# Altium project ignatova_telemetry_board.PrjPcb
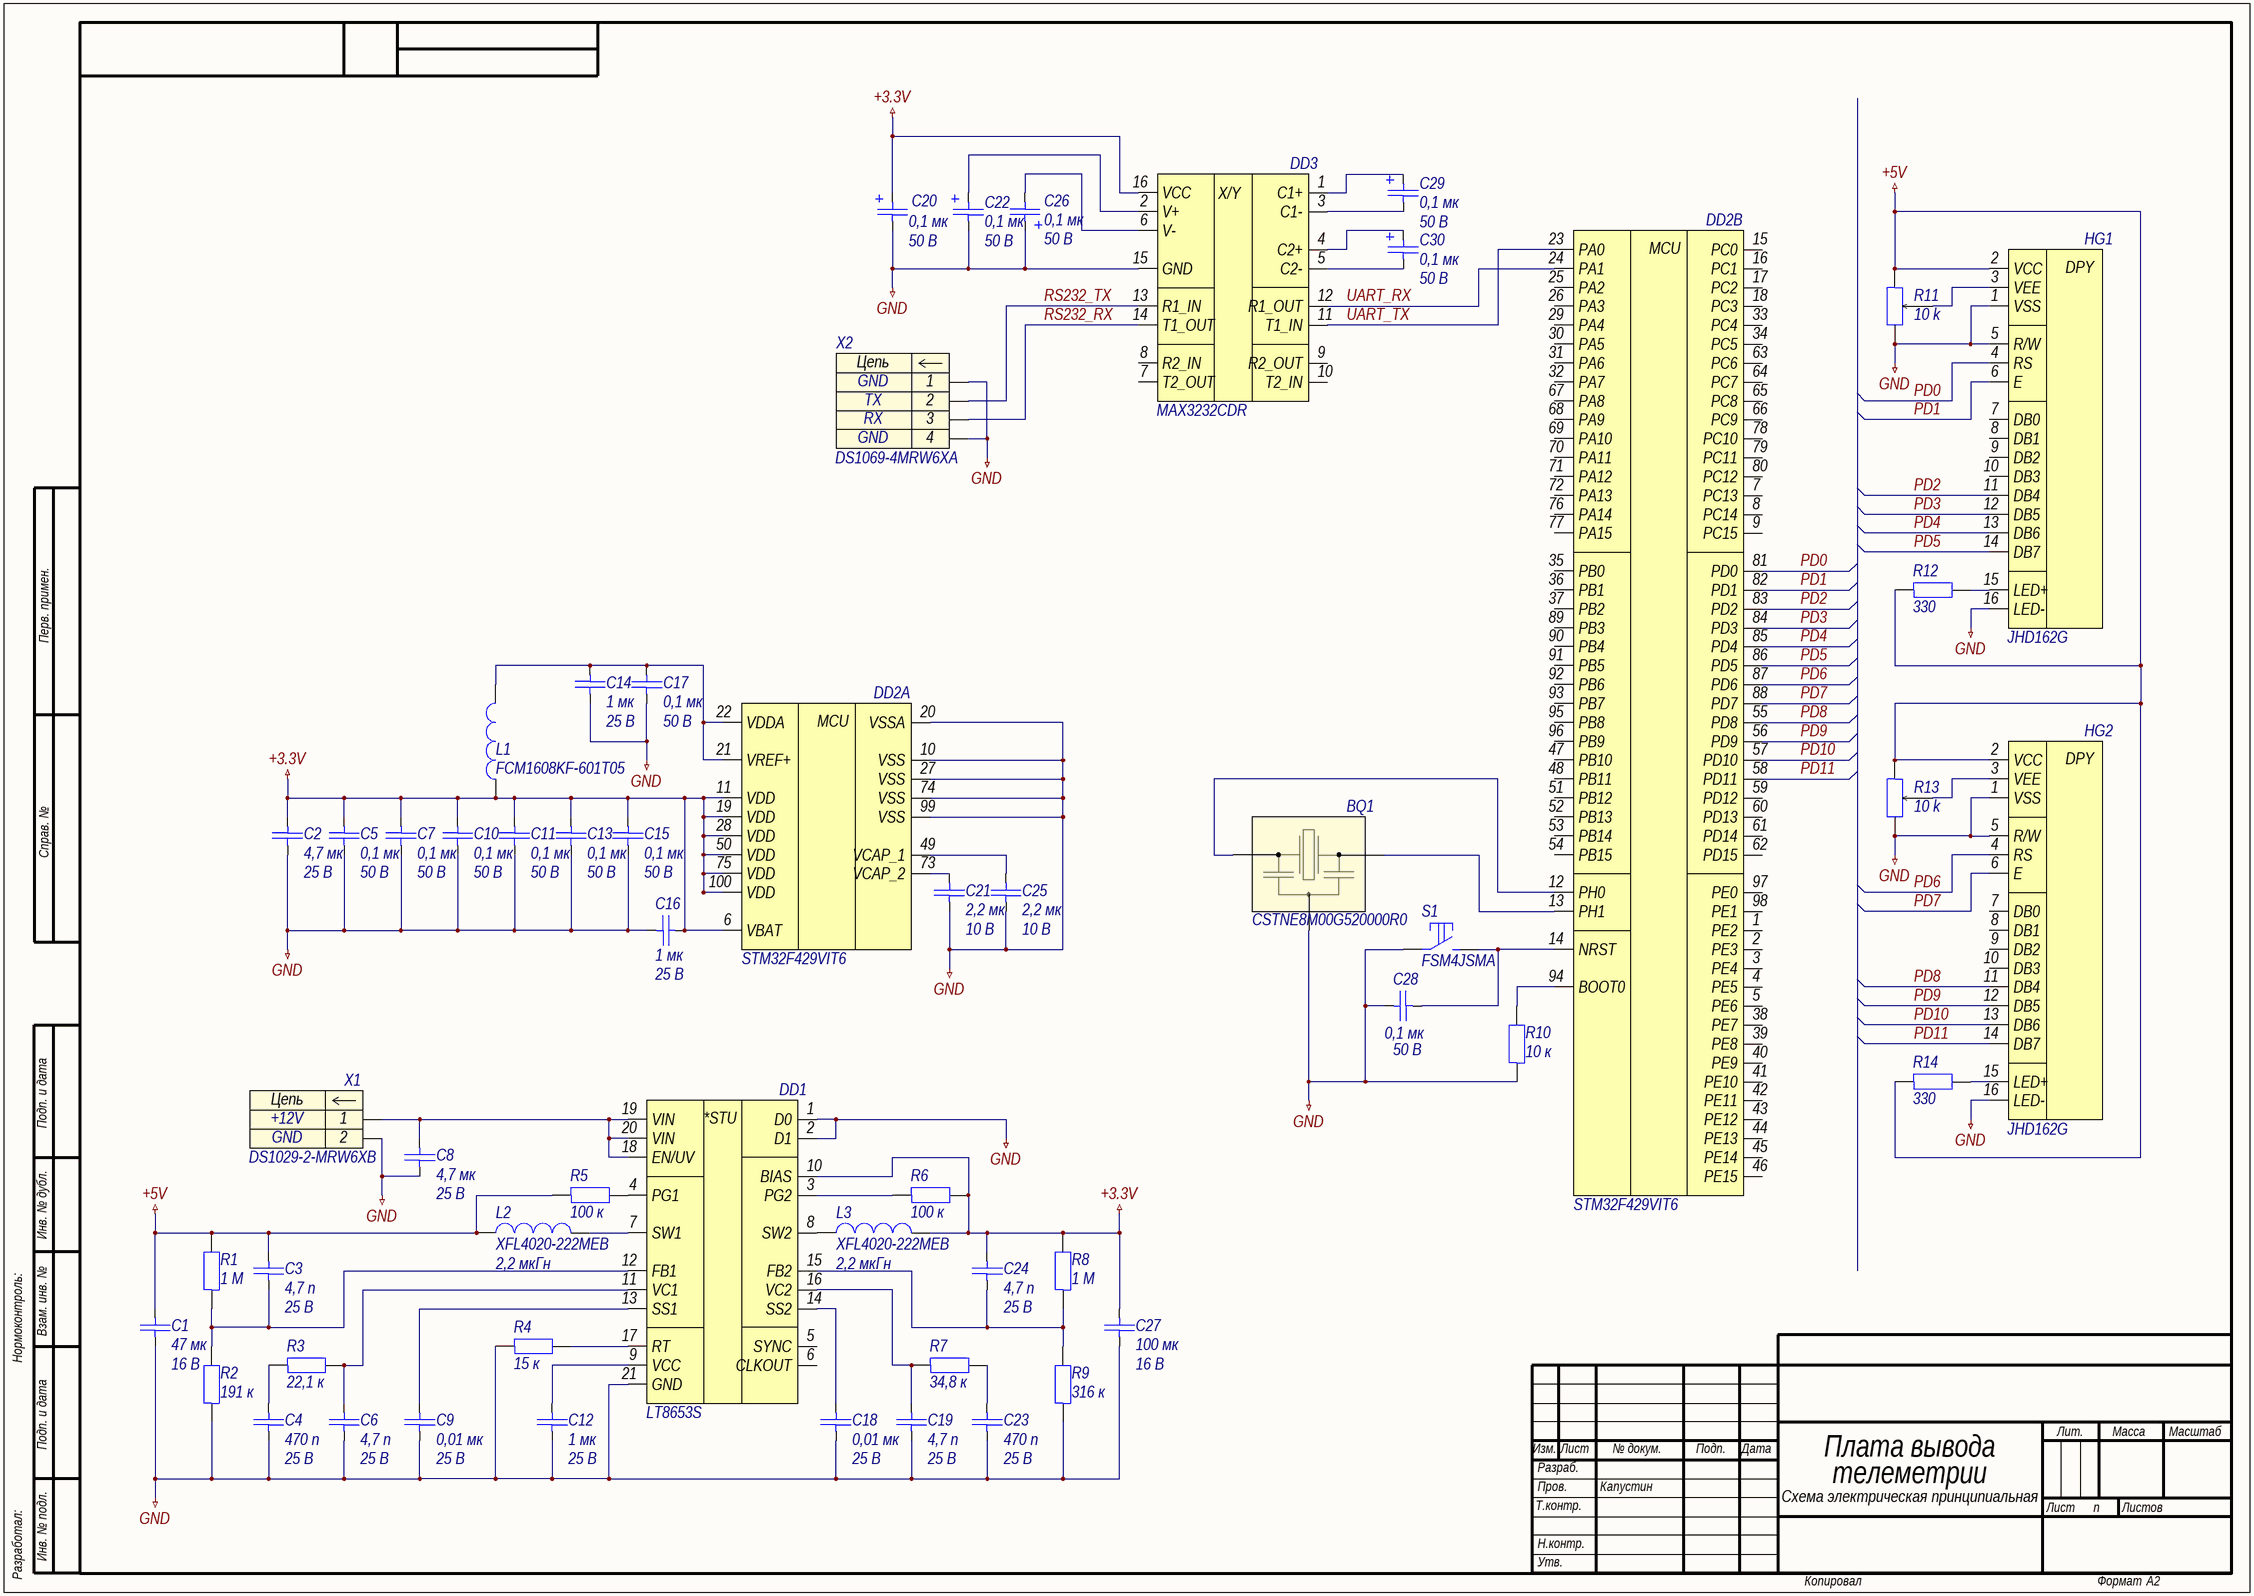
[diagram p0: ignatova_telemetry_board.SchDoc]
approver: Капустин; check: Капустин; designation: СПБПУ.3331506.007; developer: Игнатова; document_code: Ý3; document_type: Схема электрическая принципиальная; pcb_dec_number: СПБПУ.3331506.007; project: ignatova_telemetry_board; sheets_total: 1; title: Плата вывода телеметрии; title_line_1: Плата вывода; title_line_2: телеметрии
1 sheet, 56 parts. Net scope: global (net labels, ports and power ports of the same name join across sheets).
Board file: ignatova_telemetry_board.PcbDoc

## Sheet ignatova_telemetry_board.SchDoc: Плата вывода телеметрии
size 594 x 420 mm; ApprovedBy: Капустин; CheckedBy: Капустин; DrawnBy: Игнатова; DocumentNumber: СПБПУ.3331506.007Ý3; SheetNumber: n; SheetTotal: 1; DocumentCode: Ý3; ImagePath: СПБПУ.3331506.007

### Parts
BQ1  CSTNE8M00G520000R0  [CSTNE-3-320X130X70]
C1  47 мк  Напряжение: 16 В  [C1210]
C2  4,7 мк  Напряжение: 25 В  [C0603]
C3  4,7 п  Напряжение: 25 В  [C0201]
C4  470 п  Напряжение: 25 В  [C0201]
C5  0,1 мк  Напряжение: 50 В  [C0603]
C6  4,7 п  Напряжение: 25 В  [C0201]
C7  0,1 мк  Напряжение: 50 В  [C0603]
C8  4,7 мк  Напряжение: 25 В  [C0603]
C9  0,01 мк  Напряжение: 25 В  [C0201]
C10  0,1 мк  Напряжение: 50 В  [C0603]
C11  0,1 мк  Напряжение: 50 В  [C0603]
C12  1 мк  Напряжение: 25 В  [C0603]
C13  0,1 мк  Напряжение: 50 В  [C0603]
C14  1 мк  Напряжение: 25 В  [C0603]
C15  0,1 мк  Напряжение: 50 В  [C0603]
C16  1 мк  Напряжение: 25 В  [C0603]
C17  0,1 мк  Напряжение: 50 В  [C0603]
C18  0,01 мк  Напряжение: 25 В  [C0201]
C19  4,7 п  Напряжение: 25 В  [C0201]
C20  0,1 мк  Напряжение: 50 В  [C1206POLAR]
C21  2,2 мк  Напряжение: 10 В  [C0603]
C22  0,1 мк  Напряжение: 50 В  [C1206POLAR]
C23  470 п  Напряжение: 25 В  [C0201]
C24  4,7 п  Напряжение: 25 В  [C0201]
C25  2,2 мк  Напряжение: 10 В  [C0603]
C26  0,1 мк  Напряжение: 50 В  [C1206POLAR]
C27  100 мк  Напряжение: 16 В  [C1210]
C28  0,1 мк  Напряжение: 50 В  [C0603]
C29  0,1 мк  Напряжение: 50 В  [C1206POLAR]
C30  0,1 мк  Напряжение: 50 В  [C1206POLAR]
DD1  LT8653S  [LQFN-20]
DD2  STM32F429VIT6  [LQFP-100]  (parts A,B of 2)
DD3  MAX3232CDR  [SOIC-16]
HG1  JHD162G  [LCD-16x2]
HG2  JHD162G  [LCD-16x2]
L1  FCM1608KF-601T05  [BLM-2-0603]
L2  XFL4020-222MEB  Индуктивность: 2,2 мкГн  [XFL-2-430X430X210]
L3  XFL4020-222MEB  Индуктивность: 2,2 мкГн  [XFL-2-430X430X210]
R1  1 М  [R0603]
R2  191 к  [R0603]
R3  22,1 к  [R0603]
R4  15 к  [R0603]
R5  100 к  [R0603]
R6  100 к  [R0603]
R7  34,8 к  [R0603]
R8  1 М  [R0603]
R9  316 к  [R0603]
R10  10 к  [R0603]
R11  10 k  [TRIMMER-RESISTOR]
R12  330  [R0603]
R13  10 k  [TRIMMER-RESISTOR]
R14  330  [R0603]
S1  FSM4JSMA  [FSM4JSMA]
X1  DS1029-2-MRW6XB  [DS1029-2-MRW6XB]
X2  DS1069-4MRW6XA  [DS1069-4MRW6XA]

### Nets
+3.3V: C2.2 C5.2 C7.2 C10.2 C11.2 C13.2 C15.2 C16.1 C20.1 C24.1 C27.1 DD1.10(BIAS) DD2.6(VBAT) DD2.11(VDD) DD2.19(VDD) DD2.28(VDD) DD2.50(VDD) DD2.75(VDD) DD2.100(VDD) DD3.16(VCC) L1.1 L3.2 R6.2 R8.2
+5V: C1.1 C3.1 HG1.2(VCC) HG2.2(VCC) L2.1 R1.2 R5.1 R11.1 R12.1 R13.1 R14.1
GND: BQ1.2 C1.2 C2.1 C4.2 C5.1 C6.2 C7.1 C8.2 C9.2 C10.1 C11.1 C12.2 C13.1 C14.1 C15.1 C16.2 C17.2 C18.2 C19.2 C20.2 C21.2 C22.2 C23.2 C25.2 C26.1 C27.2 C28.1 DD1.1(D0) DD1.2(D1) DD1.21(GND) DD2.10(VSS) DD2.20(VSSA) DD2.27(VSS) DD2.74(VSS) DD2.99(VSS) DD3.15(GND) HG1.1(VSS) HG1.5(R/W) HG1.16(LED-) HG2.1(VSS) HG2.5(R/W) HG2.16(LED-) R2.1 R4.1 R9.1 R10.1 R11.3 R13.3 S1.1 X1.2 X2.1 X2.4
PD0: DD2.81(PD0) HG1.4(RS)
PD1: DD2.82(PD1) HG1.6(E)
PD2: DD2.83(PD2) HG1.11(DB4)
PD3: DD2.84(PD3) HG1.12(DB5)
PD4: DD2.85(PD4) HG1.13(DB6)
PD5: DD2.86(PD5) HG1.14(DB7)
PD6: DD2.87(PD6) HG2.4(RS)
PD7: DD2.88(PD7) HG2.6(E)
PD8: DD2.55(PD8) HG2.11(DB4)
PD9: DD2.56(PD9) HG2.12(DB5)
PD10: DD2.57(PD10) HG2.13(DB6)
PD11: DD2.58(PD11) HG2.14(DB7)
RS232_RX: DD3.14(T1_OUT) X2.3
RS232_TX: DD3.13(R1_IN) X2.2
UART_RX: DD2.24(PA1) DD3.12(R1_OUT)
UART_TX: DD2.23(PA0) DD3.11(T1_IN)
NetBQ1_1: BQ1.1 DD2.13(PH1)
NetBQ1_3: BQ1.3 DD2.12(PH0)
NetC3_2: C3.2 DD1.12(FB1) R1.1 R2.2
NetC4_1: C4.1 R3.1
NetC6_1: C6.1 DD1.11(VC1) R3.2
NetC8_1: C8.1 DD1.18(EN/UV) DD1.19(VIN) DD1.20(VIN) X1.1
NetC9_1: C9.1 DD1.13(SS1)
NetC12_1: C12.1 DD1.9(VCC)
NetC14_2: C14.2 C17.1 DD2.21(VREF+) DD2.22(VDDA) L1.2
NetC18_1: C18.1 DD1.14(SS2)
NetC19_1: C19.1 DD1.16(VC2) R7.1
NetC21_1: C21.1 DD2.73(VCAP_2)
NetC22_1: C22.1 DD3.2(V+)
NetC23_1: C23.1 R7.2
NetC24_2: C24.2 DD1.15(FB2) R8.1 R9.2
NetC25_1: C25.1 DD2.49(VCAP_1)
NetC26_2: C26.2 DD3.6(V-)
NetC28_2: C28.2 DD2.14(NRST) S1.2
NetC29_1: C29.1 DD3.1(C1+)
NetC29_2: C29.2 DD3.3(C1-)
NetC30_1: C30.1 DD3.4(C2+)
NetC30_2: C30.2 DD3.5(C2-)
NetDD1_3: DD1.3(PG2) R6.1
NetDD1_4: DD1.4(PG1) R5.2
NetDD1_7: DD1.7(SW1) L2.2
NetDD1_8: DD1.8(SW2) L3.1
NetDD1_17: DD1.17(RT) R4.2
NetDD2_94: DD2.94(BOOT0) R10.2
NetHG1_3: HG1.3(VEE) R11.2
NetHG1_15: HG1.15(LED+) R12.2
NetHG2_3: HG2.3(VEE) R13.2
NetHG2_15: HG2.15(LED+) R14.2

Not connected (* = marked no-connect by the designer): DD1 5(SYNC) 6(CLKOUT); DD2 1(PE2) 2(PE3) 3(PE4) 4(PE5) 5(PE6) 7(PC13) 8(PC14) 9(PC15) 15(PC0) 16(PC1) 17(PC2) 18(PC3) 25(PA2) 26(PA3) 29(PA4) 30(PA5) 31(PA6) 32(PA7) 33(PC4) 34(PC5) 35(PB0) 36(PB1) 37(PB2) 38(PE7) 39(PE8) 40(PE9) 41(PE10) 42(PE11) 43(PE12) 44(PE13) 45(PE14) 46(PE15) 47(PB10) 48(PB11) 51(PB12) 52(PB13) 53(PB14) 54(PB15) 59(PD12) 60(PD13) 61(PD14) 62(PD15) 63(PC6) 64(PC7) 65(PC8) 66(PC9) 67(PA8) 68(PA9) 69(PA10) 70(PA11) 71(PA12) 72(PA13) 76(PA14) 77(PA15) 78(PC10) 79(PC11) 80(PC12) 89(PB3) 90(PB4) 91(PB5) 92(PB6) 93(PB7) 95(PB8) 96(PB9) 97(PE0) 98(PE1); DD3 7(T2_OUT) 8(R2_IN) 9(R2_OUT) 10(T2_IN); HG1 7(DB0) 8(DB1) 9(DB2) 10(DB3); HG2 7(DB0) 8(DB1) 9(DB2) 10(DB3)

### Notes on the sheet
- Перв. примен.
- Справ. №
- Подп. и дата
- Инв. № дубл.
- Нормоконтроль:
- Взам. инв. №
- Изм.
- Лист
- № докум.
- Подп.
- Дата
- Лит.
- Масса
- Масштаб
- Т.контр.
- Пров.
- Разраб.
- Листов
- Разработал:
- Инв. № подл.
- Н.контр.
- Утв.
- Копировал
- Формат
- А2
- (in symbol dd0009) *STU
- (in symbol JHD162G) DPY
- (in symbol MAX3232CDR) X/Y
- (in symbol STM32F429VIT6, part A) MCU
- (in symbol STM32F429VIT6, part B) MCU
- (in symbol x0006) Цепь
- (in symbol x0009) Цепь

### Library data of the parts
BQ1 = q0002: =Описание; ID: q0002; Фамилия: Игнатова; Описание: Кварцевый резонатор 8 МГц; Производитель: Murata Manufacturing Co., Ltd.; Частота: 8 МГц; Корпус: 3,2 x 1,3 x 0,7; Наименование: CSTNE8M00G520000R0
C1 = c0047: =Описание; ID: c0047; Фамилия: Игнатова; Описание: Конденсатор чип 1210 47 мкФ 16 В ±10 %; Наименование: CL32A476KOJNNNE; Производитель: Samsung electro-mechanics; Отклонение: ±10 %; Рабочие температуры: от -55 °С до +85 °С; Корпус: 1210; Номинал: 47 мк; Номинальное напряжение: 16 В
C2 C8 = c0029: =Описание; ID: c0029; Фамилия: Ларионов; Описание: Конденсатор чип 0603 4,7 мкФ 25 В ±10 %; Наименование: CC0603KRX5R8BB475; Производитель: YAGEO Corp.; Отклонение: ±10 %; Рабочие температуры: от -55 °С до +85 °С; Корпус: 0603; Номинал: 4,7 мк; Номинальное напряжение: 25 В; HelpURL: https://www.yageo.com/upload/media/product/productsearch/datasheet/mlcc/UPY-GPHC_X5R_4V-to-50V_26.pdf
C3 C6 C19 C24 = c0045: =Описание; ID: c0045; Фамилия: Игнатова; Описание: Конденсатор чип 0201 4,7 пФ 25 В ±25 %; Наименование: CL03C4R7CA3GNNC; Производитель: Samsung electro-mechanics; Отклонение: ±25 %; Рабочие температуры: от -55 °С до +125 °С; Корпус: 0201; Номинал: 4,7 п; Номинальное напряжение: 25 В
C4 C23 = c0044: =Описание; ID: c0044; Фамилия: Игнатова; Описание: Конденсатор чип 0201 470 пФ 25 В ±10 %; Наименование: CL03B471KA3NNNC; Производитель: Samsung electro-mechanics; Отклонение: ±10 %; Рабочие температуры: от -55 °С до +125 °С; Корпус: 0201; Номинал: 470 п; Номинальное напряжение: 25 В
C5 C7 C10 C11 C13 C15 C17 C28 = c0018: =Описание; ID: c0018; Фамилия: Ларионов; Описание: Конденсатор чип 0603 0,1 мкФ 50 В ±5 %; Наименование: CC0603JRX7R9BB104; Производитель: YAGEO Corp.; Отклонение: ±5 %; Рабочие температуры: от -55 °С до +125 °С; Корпус: 0603; Номинал: 0,1 мк; Номинальное напряжение: 50 В; HelpURL: https://www.yageo.com/upload/media/product/products/datasheet/mlcc/UPY-GPHC_X7R_6.3V-to-50V_20.pdf
C9 C18 = c0046: =Описание; ID: c0046; Фамилия: Игнатова; Описание: Конденсатор чип 0201 10 нФ 25 В ±10 %; Наименование: CC0201KRX7R8BB103; Производитель: YAGEO Corp.; Номинал: 10 н; Отклонение: ±10 %; Рабочие температуры: от -55 °С до +85 °С; Корпус: 0201; Номинальное напряжение: 25 В
C12 C14 C16 = c0022: =Описание; ID: c0022; Фамилия: Ларионов; Описание: Конденсатор чип 0603 1 мкФ 25 В ±10 %; Наименование: CC0603KRX7R8BB105; Производитель: YAGEO Corp.; Отклонение: ±10 %; Рабочие температуры: от -55 °С до +125 °С; Корпус: 0603; Номинал: 1 мк; Номинальное напряжение: 25 В; HelpURL: https://www.yageo.com/upload/media/product/products/datasheet/mlcc/UPY-GPHC_X7R_6.3V-to-50V_20.pdf
C20 C22 C26 C29 C30 = c0039: =Описание; ID: c0039; Фамилия: Ларионов; Описание: Конденсатор чип 1206 0,1 мкФ 50 В ±10 % полярный; Наименование: 293D104X9050A2TE3; Производитель: Vishay Intertechnology, Inc.; Отклонение: ±10 %; Рабочие температуры: от -55 °С до +125 °С; Корпус: 1206; Номинал: 0,1 мк; Номинальное напряжение: 50 В; HelpURL: https://www.vishay.com/capacitors/list/product-40002/
C21 C25 = c0025: =Описание; ID: c0025; Фамилия: Чернов; Описание: Конденсатор чип 0603 2,2 мкФ 10 В ±10 %; Наименование: CC0603KRX7R6BB225; Производитель: YAGEO Corp.; Отклонение: ±10 %; Рабочие температуры: от -55 °С до +125 °С; Корпус: 0603; Номинал: 2,2 мк; Номинальное напряжение: 10 В; HelpURL: https://www.yageo.com/upload/media/product/productsearch/datasheet/mlcc/UPY-GPHC_X7R_6.3V-to-50V_20.pdf
C27 = c0048: =Описание; ID: c0048; Фамилия: Игнатова; Описание: Конденсатор чип 1210 100 мкФ 16 В ±20 %; Наименование: CC1210MKX5R7BB107; Производитель: YAGEO Corp.; Отклонение: ±20 %; Рабочие температуры: от -55 °С до +85 °С; Корпус: 1210; Номинал: 100 мк; Номинальное напряжение: 16 В
DD1 = dd0009: =Описание; ID: dd0009; Фамилия: Игнатова; Описание: Двухканальный понижающий преобразователь напряжения 42 В и 2А; Производитель: Analog Devices; Входное напряжение: от 3 В до 42 В; Выходное напряжение: от 1,8 В до 5 В; Коммутируемый ток: до 2 А; Частота переключения: от 300 кГц до 3 МГц; Рабочие температуры: от -40 °С до +125 °С; Наименование: LT8653S; Корпус: LQFN-20
DD2 = STM32F429VIT6: =Описание
DD3 = MAX3232CDR: =Описание
HG1 HG2 = JHD162G: =Описание
L1 = l0003: =Описание; ID: l0003; Фамилия: Игнатова; Описание: Ферритовая бусина 600 Ом ±25 %; Производитель: Tai-tech; Сопротивление, 100 МГц: 600 Ом; Отклонение, 100 Мгц: ±25 %; Сопротивление при постоянном токе: 0,5 Ом; Рабочие температуры: от -55 °С до +125 °С; Корпус: 0603; Наименование: FCM1608KF-601T05
L2 L3 = l0007: =Описание; ID: l0007; Фамилия: Игнатова; Описание: Индуктивность 2,2 мкГн ±20 %; Производитель: Coilcraft Inc.; Отклонение: ±20 %; Номинальное активное сопротивление: 21,35 мОм; Максимальное активное сопротивление: 23,5 мОм; Резонансная частота: 38 МГц; Номинальный ток (при нагреве на 20 °С/40 °С): 8 А; Ток насыщения: 3,5 А; Рабочее напряжение: от 0 В до 20 В; Рабочие температуры: от -40 °С до +125 °С; Корпус: 4,3 x 4,3 x 2,1; Наименование: XFL4020-222MEB; Номинал: 2,2 мкГн
R1 R8 = r0081: =Описание; ID: r0081; Фамилия: Ляпцев; Описание: Резистор чип 0603 1 МОм ±1 % 0,1 Вт; Наименование: RC0603FR-071ML; Производитель: YAGEO Corp.; Отклонение: ±1 %; Номинальное напряжение: 75 В; Рабочие температуры: от -55 °С до +155 °С; Номинальный ток: 1 А; Корпус: 0603; Номинал: 1 М; HelpURL: https://www.yageo.com/upload/media/product/productsearch/datasheet/rchip/PYu-RC_Group_51_RoHS_L_11.pdf
R2 = r0084: =Описание; ID: r0084; Фамилия: Игнатова; Описание: Резистор чип 0603 191 кОм ±1 % 0,1 Вт; Наименование: RC0603FR-13191KL; Производитель: YAGEO Corp.; Отклонение: ±1 %; Номинальное напряжение: 75 В; Рабочие температуры: от -55 °С до +155 °С; Номинальный ток: 1 А; Корпус: 0603; Номинал: 191 к
R3 = r0086: =Описание; ID: r0086; Фамилия: Игнатова; Описание: Резистор чип 0603 22,1 кОм ±1 % 0,1 Вт; Наименование: RC0603FR-1322K1L; Производитель: YAGEO Corp.; Отклонение: ±1 %; Номинальное напряжение: 75 В; Рабочие температуры: от -55 °С до +155 °С; Номинальный ток: 1 А; Корпус: 0603; Номинал: 22,1 к
R4 = r0046: =Описание; ID: r0046; Фамилия: Паньков; Описание: Резистор чип 0603 15 кОм ±1 % 0,1 Вт; Наименование: RC0603FR-0715KL; Производитель: YAGEO Corp.; Отклонение: ±1 %; Номинальное напряжение: 75 В; Рабочие температуры: от -55 °С до +155 °С; Номинальный ток: 1 А; Корпус: 0603; Номинал: 15 к; HelpURL: https://www.yageo.com/upload/media/product/productsearch/datasheet/rchip/PYu-RC_Group_51_RoHS_L_11.pdf
R5 R6 = r0073: =Описание; ID: r0073; Фамилия: Водорезов; Описание: Резистор чип 0603 100 кОм ±1 % 0,1 Вт; Наименование: RC0603FR-07100KL; Производитель: YAGEO Corp.; Отклонение: ±1 %; Номинальное напряжение: 75 В; Рабочие температуры: от -55 °С до +155 °С; Номинальный ток: 1 А; Корпус: 0603; Номинал: 100 к; HelpURL: https://www.yageo.com/upload/media/product/productsearch/datasheet/rchip/PYu-RC_Group_51_RoHS_L_11.pdf
R7 = r0087: =Описание; ID: r0087; Фамилия: Игнатова; Описание: Резистор чип 0603 34,8 кОм ±1 % 0,1 Вт; Наименование: RC0603FR-1334K8L; Производитель: YAGEO Corp.; Отклонение: ±1 %; Номинальное напряжение: 75 В; Рабочие температуры: от -55 °С до +155 °С; Номинальный ток: 1 А; Корпус: 0603; Номинал: 34,8 к
R9 = r0085: =Описание; ID: r0085; Фамилия: Игнатова; Описание: Резистор чип 0603 316 кОм ±1 % 0,1 Вт; Наименование: RC0603FR-13316KL; Производитель: YAGEO Corp.; Отклонение: ±1 %; Номинальное напряжение: 75 В; Рабочие температуры: от -55 °С до +155 °С; Номинальный ток: 1 А; Корпус: 0603; Номинал: 316 к
R10 = r0040: =Описание; ID: r0040; Фамилия: Самарин; Описание: Резистор чип 0603 10 кОм ±1 % 0,1 Вт; Наименование: RC0603FR-0710KL; Производитель: YAGEO Corp.; Отклонение: ±1 %; Номинальное напряжение: 75 В; Рабочие температуры: от -55 °С до +155 °С; Номинальный ток: 1 А; Корпус: 0603; Номинал: 10 к; HelpURL: https://www.yageo.com/upload/media/product/productsearch/datasheet/rchip/PYu-RC_Group_51_RoHS_L_11.pdf
R11 R13 = TRIMMER-RESISTOR: =Описание
R12 R14 = r0010: =Описание; ID: r0010; Фамилия: Ларионов; Описание: Резистор чип 0603 330 Ом ±1 % 0,1 Вт; Наименование: RC0603FR-07330RL; Производитель: YAGEO Corp.; Отклонение: ±1 %; Номинальное напряжение: 75 В; Рабочие температуры: от -55 °С до +155 °С; Номинальный ток: 1 А; Корпус: 0603; Номинал: 330; HelpURL: https://www.yageo.com/upload/media/product/productsearch/datasheet/rchip/PYu-RC_Group_51_RoHS_L_11.pdf
S1 = sw0002: =Описание; ID: sw0002; Фамилия: Паньков; Описание: Тактовая кнопка поверхностного монтажа; Производитель: TE Connectivity; Ток нагрузки: 50 мА @ 24 В; Сопротивление контакта: 100 мОм; Количество контактов: 1; Рабочие температуры: от -35 °С до +85 °С; Промывка: Разрешена; Корпус: 6,00x6,00x4,98; Наименование: FSM4JSMA; HelpURL: https://www.te.com/usa-en/product-4-1437565-1.html
X1 = x0006: =Описание; Contact_1: +12V; Contact_2: GND; ID: x0006; Фамилия: Ларионов; Описание: CWF 2 pin Type B 2,5 мм вилка угловой; Производитель: Connfly Electronic Co. LTD.; Наименование: DS1029-2-MRW6XB; HelpURL: http://www.connfly.com/productshow.aspx?id=352
X2 = x0009: =Описание; Contact_1: GND; Contact_2: TX; Contact_3: RX; ID: x0009; Фамилия: Паньков; Описание: CWF 4 pin Type A 2,5 мм вилка угловой; Производитель: Connfly Electronic Co., Ltd.; Contact_4: GND; Наименование: DS1069-4MRW6XA; HelpURL: http://en.connfly.group/product/xVkr=EusQssAN0gN=Aos=mU+UrVkR9kqEAN0gN0MUR+g+NB+A